# Altium project TechnoPoliceBadge.PrjPcb
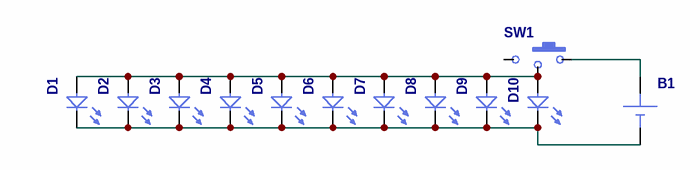
[diagram p0: TechnoPoliceBadge.SchDoc]
1 sheet, 12 parts. Net scope: global (net labels, ports and power ports of the same name join across sheets).
Board file: TechnoPoliceBadge.PcbDoc

## Sheet TechnoPoliceBadge.SchDoc
size A4; Organization: InMotion sp. z o.o.; Address1: Podole 60; Address2: Krakow; Address3: NSW; Address4: Poland; Revision: Rev 0

### Parts
B1  BAT-HLD-001-TR  [BAT-HLD-001]  (value not drawn)
D1  OL_RGB_IC_0807  [OL_0807]  (value not drawn)
D2  OL_RGB_IC_0807  [OL_0807]  (value not drawn)
D3  OL_RGB_IC_0807  [OL_0807]  (value not drawn)
D4  OL_RGB_IC_0807  [OL_0807]  (value not drawn)
D5  OL_RGB_IC_0807  [OL_0807]  (value not drawn)
D6  OL_RGB_IC_0807  [OL_0807]  (value not drawn)
D7  OL_RGB_IC_0807  [OL_0807]  (value not drawn)
D8  OL_RGB_IC_0807  [OL_0807]  (value not drawn)
D9  OL_RGB_IC_0807  [OL_0807]  (value not drawn)
D10  OL_RGB_IC_0807  [OL_0807]  (value not drawn)
SW1  MSK-12C01-07  [MSK-12C01-07]  (value not drawn)

### Nets
NetB1_NEG: B1.NEG D1.1(C) D2.1(C) D3.1(C) D4.1(C) D5.1(C) D6.1(C) D7.1(C) D8.1(C) D9.1(C) D10.1(C)
NetB1_POS: B1.POS SW1.3
NetD1_2: D1.2(A) D2.2(A) D3.2(A) D4.2(A) D5.2(A) D6.2(A) D7.2(A) D8.2(A) D9.2(A) D10.2(A) SW1.2

Not connected (* = marked no-connect by the designer): SW1 1

### Notes on the sheet
- Title
- Size:
- Date:
- A4

### Library data of the parts
B1 = BAT-HLD-001-TR: Coin Cell Battery Holders Linx CR2032 Battery Holder, Tape n Reel; Manufacturer: Linx Technologies; Part Number: BAT-HLD-001-TR; Case/Package: SMD; Manufacturer Part Number: BAT-HLD-001-TR; HelpURL: https://pl.mouser.com/datasheet/2/238/bat-hld-001-1659379.pdf; Max Operating Temperature: 0°C; Min Operating Temperature: 0°C; Mount: Surface Mount; Status: MK; Supplier 1: Mouser; Supplier Part Number 1: 712-BAT-HLD-001-TR
D1-D10 = OL_RGB_IC_0807: RGB Diode with integrated driver. Fast Flashing; Manufacturer: Aliexpress; Manufacturer Part Number: None; Part Number: OL_RGB_IC_0807; Case/Package: 0807; Color: RGB; Mount: Surface Mount; Height: 0.8; HelpURL: https://www.aliexpress.com/item/32771234486.html?spm=a2g0s.9042311.0.0.33ca4c4d1FJqnV; Max Operating Temperature: 85; Status: MK; Number of Pins: 4; Supplier 1: Aliexpress
SW1 = MSK-12C01-07: SMT Slide Switch; Max Current: 100mA; Max Voltage Rating (DC): 50V; Switch Function: On-On; Throw Configuration: SP-DT; Part Number: MSK-12C01-07; Manufacturer Part Number: MSK-12C01-07; Orientation: Horizontal; Mount: Surface Mount; HelpURL: https://www.aliexpress.com/item/32856542440.html?spm=a2g0s.9042311.0.0.33ca4c4d1FJqnV; Height: 1.5mm; Status: MK; Supplier 1: Aliexpress